# Altium schematic sheet Hex-Inverter2.SchDoc
size A; SheetNumber: 3; SheetTotal: 3
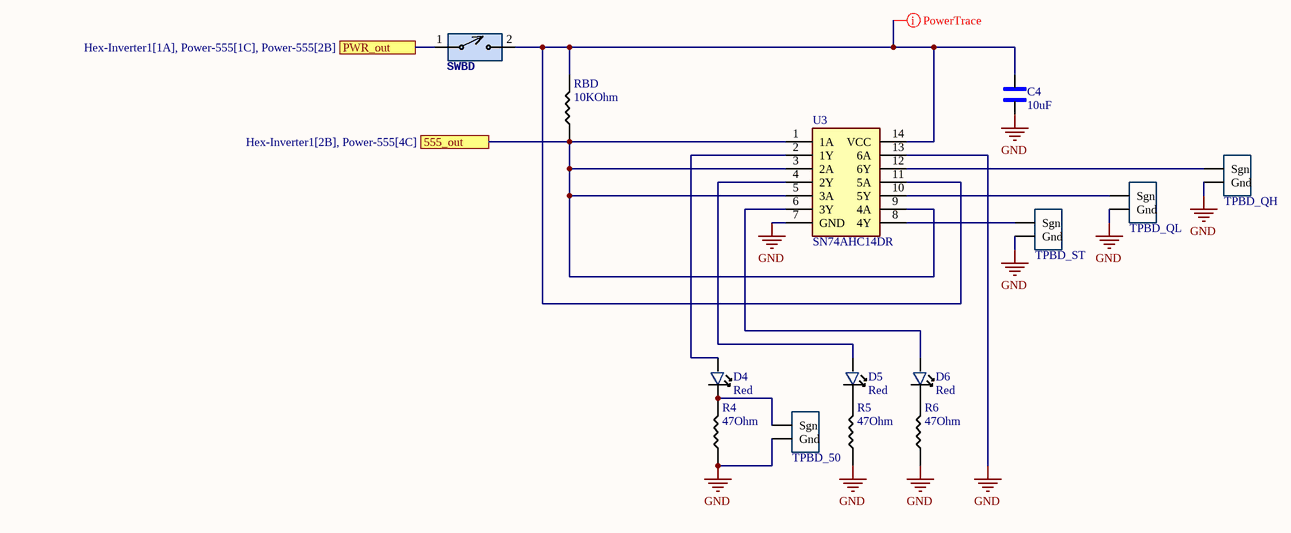
[diagram p0: Hex-Inverter2.SchDoc]

## Parts
C4  10uF  [1206_Passive_Capacitor]
D4  Red  [LED_1206]
D5  Red  [LED_1206]
D6  Red  [LED_1206]
R4  value 47Ohm  [1206_Passive_Resitor]  (hidden comment: 47 Ohms)
R5  value 47Ohm  [1206_Passive_Resitor]  (hidden comment: 47 Ohms)
R6  value 47Ohm  [1206_Passive_Resitor]  (hidden comment: 47 Ohms)
RBD  value 10KOhm  [1206_Passive_Resitor]  (hidden comment: 10k)
SWBD  SW_2Pin_100mil_Switch  [2Pin-Header-Conn]  (value not drawn)
TPBD_50  10x Probe TP  [TP10x_Probe]  (value not drawn)
TPBD_QH  10x Probe TP  [TP10x_Probe]  (value not drawn)
TPBD_QL  10x Probe TP  [TP10x_Probe]  (value not drawn)
TPBD_ST  10x Probe TP  [TP10x_Probe]  (value not drawn)
U3  SN74AHC14DR  [HEX_74AC14]

## Ports
555_out (see Hex-Inverter1[2B], Power-555[4C]), PWR_out (see Hex-Inverter1[1A], Power-555[1C], Power-555[2B])

## Nets
GND: C4.1 R4.1 R5.1 R6.1 TPBD_50.2(Gnd) TPBD_QH.2(Gnd) TPBD_QL.2(Gnd) TPBD_ST.2(Gnd) U3.7(GND) U3.13(6A)
555_out: RBD.1 U3.1(1A) U3.3(2A) U3.5(3A) U3.9(4A) ; port 555_out
PWR_out: SWBD.1 ; port PWR_out
NetC4_2: C4.2 RBD.2 SWBD.2 U3.11(5A) U3.14(VCC)
NetD4_1: D4.1 U3.2(1Y)
NetD4_2: D4.2 R4.2 TPBD_50.1(Sgn)
NetD5_1: D5.1 U3.4(2Y)
NetD5_2: D5.2 R5.2
NetD6_1: D6.1 U3.6(3Y)
NetD6_2: D6.2 R6.2
NetTPBD_QH_1: TPBD_QH.1(Sgn) U3.12(6Y)
NetTPBD_QL_1: TPBD_QL.1(Sgn) U3.10(5Y)
NetTPBD_ST_1: TPBD_ST.1(Sgn) U3.8(4Y)

## Layout directives
rule Width Constraint [Pref Width = 20mil    Min Width = 10mil    Max Width = 50mil]: NetC4_2

## Library data of the parts
C4 = C_10uF_1206: 10uF ±10% 50V X5R 1206 Multilayer Ceramic Capacitors MLCC - SMD/SMT RoHS; MFR Part #: CL31A106KBHNNNE; Type: Basic; LCSC Part#: C13585; Datasheet: https://datasheet.lcsc.com/lcsc/1810221112_Samsung-Electro-Mechanics-CL31A106KBHNNNE_C13585.pdf; Value: 10uF
D4-D6 = LED_RED_1206: Red 621~631nm 1206 Light Emitting Diodes (LED) RoHS; MFR Part #: 15-21/R6C-FQ1R1B/2T; Type: Extended; LCSC Part#: C93133; Datasheet: https://datasheet.lcsc.com/szlcsc/1811151241_Everlight-Elec-15-21-R6C-FQ1R1B-2T_C93133.pdf; Value: Red
R4-R6 = R_47Ohm_1206: 47Ω ±5% 0.25W ±200ppm/℃ 1206 Chip Resistor - Surface Mount RoHS; MFR Part #: 1206W4J0470T5E; LCSC Part#: C25384; Type: Extended; Datasheet: https://datasheet.lcsc.com/lcsc/1811101020_UNI-ROYAL-Uniroyal-Elec-1206W4J0470T5E_C25384.pdf
RBD = R_10KOhm_1206: 10 kOhms ±5% 0.25W, 1/4W Chip Resistor 1206 (3216 Metric) Automotive AEC-Q200 Thick Film; MFR Part #: RMCF1206FT10K0; Digikey Link: https://www.digikey.com/en/products/detail/stackpole-electronics-inc/RMCF1206FT10K0/1759669; LCSC Part#: C17902; Type: Basic
SWBD = SW_2Pin_100mil_Switch: 2Pin Header; LCSC Part#: C124375; Type: Extended
TPBD_50 TPBD_QH TPBD_QL TPBD_ST = TP_10x_Probe: Test Point 300 mil centers
U3 = U_74AHC14: Inverter IC 6 Channel Schmitt Trigger 14-SOIC; Datasheet: https://datasheet.lcsc.com/szlcsc/ON-Semicon-ON-74AC14SCX_C5482.pdf; MFR Part #: SN74AHC14DR; LCSC Part#: C6942; Type: Extended